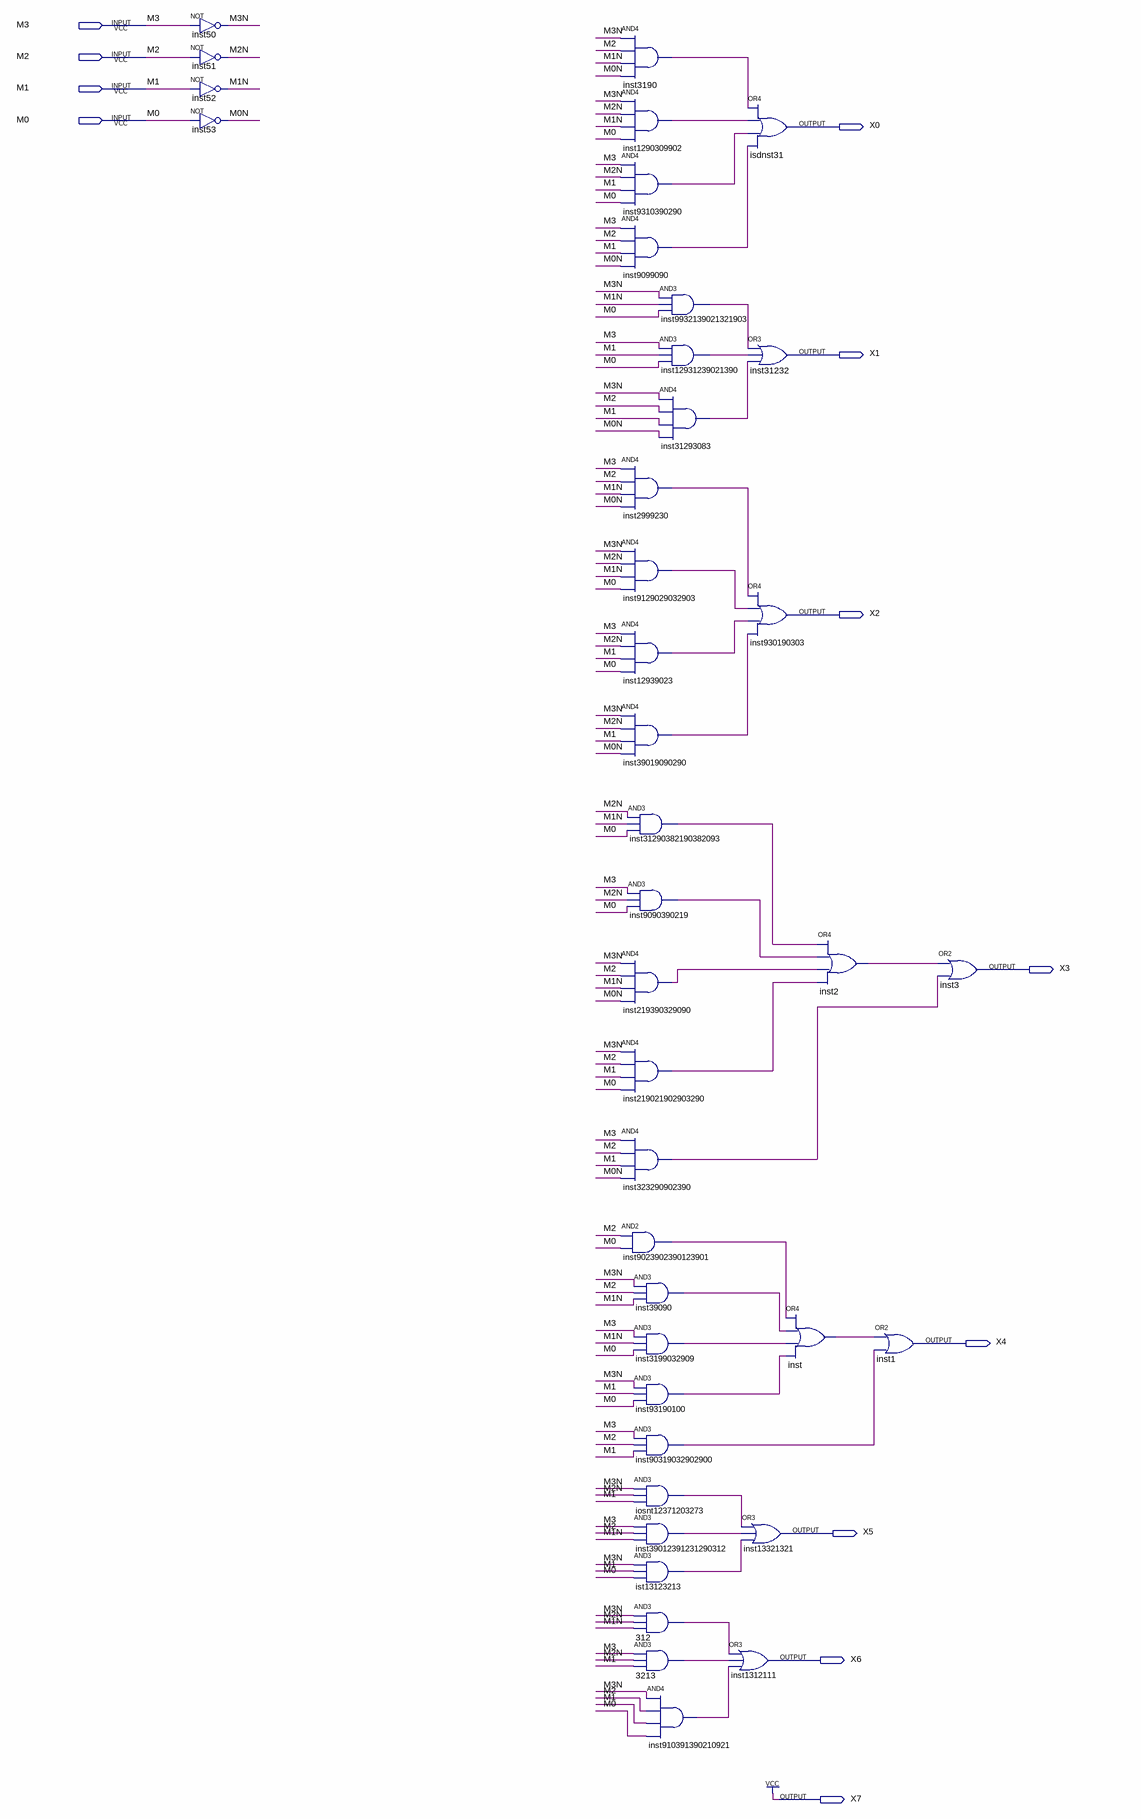
[diagram p0: schematic sheet]
// Quartus schematic sevenSegmentDecoder.bdf as structural Verilog: 40 symbols, 12 pins
module sevenSegmentDecoder (
  input  M3,
  input  M2,
  input  M1,
  input  M0,
  output X0,
  output X1,
  output X2,
  output X3,
  output X4,
  output X5,
  output X6,
  output X7
);

  wire inst2_out, inst3190_out, inst39090_out, inst2999230_out, inst9099090_out, inst12939023_out,
       inst31293083_out, inst93190100_out, inst1290309902_out, inst3199032909_out, inst9090390219_out,
       inst9310390290_out, inst39019090290_out, inst219390329090_out, inst323290902390_out,
       inst9129029032903_out, inst12931239021390_out, inst90319032902900_out, inst219021902903290_out,
       inst910391390210921_out, inst9023902390123901_out, inst9932139021321903_out,
       inst31290382190382093_out, inst39012391231290312_out, inst_out, iosnt12371203273_out, ist13123213_out,
       M0N, M1N, M2N, M3N, n312_out, n3213_out;

  not inst50 (M3N, M3);
  not inst51 (M2N, M2);
  not inst52 (M1N, M1);
  not inst53 (M0N, M0);
  and inst3190 (inst3190_out, M3N, M2, M1N, M0N);
  and inst1290309902 (inst1290309902_out, M3N, M2N, M1N, M0);
  and inst9310390290 (inst9310390290_out, M3, M2N, M1, M0);
  and inst9099090 (inst9099090_out, M3, M2, M1, M0N);
  and inst2999230 (inst2999230_out, M3, M2, M1N, M0N);
  and inst9129029032903 (inst9129029032903_out, M3N, M2N, M1N, M0);
  and inst12939023 (inst12939023_out, M3, M2N, M1, M0);
  and inst39019090290 (inst39019090290_out, M3N, M2N, M1, M0N);
  and inst31290382190382093 (inst31290382190382093_out, M2N, M1N, M0);
  and inst9090390219 (inst9090390219_out, M3, M2N, M0);
  and inst219390329090 (inst219390329090_out, M3N, M2, M1N, M0N);
  and inst219021902903290 (inst219021902903290_out, M3N, M2, M1, M0);
  and inst323290902390 (inst323290902390_out, M3, M2, M1, M0N);
  and inst9023902390123901 (inst9023902390123901_out, M2, M0);
  and inst39090 (inst39090_out, M3N, M2, M1N);
  and inst3199032909 (inst3199032909_out, M3, M1N, M0);
  and inst93190100 (inst93190100_out, M3N, M1, M0);
  and inst90319032902900 (inst90319032902900_out, M3, M2, M1);
  and iosnt12371203273 (iosnt12371203273_out, M3N, M2N, M1);
  and inst39012391231290312 (inst39012391231290312_out, M3, M2, M1N);
  and ist13123213 (ist13123213_out, M3N, M1, M0);
  and u_312 (n312_out, M3N, M2N, M1N);
  and u_3213 (n3213_out, M3, M2N, M1);
  and inst910391390210921 (inst910391390210921_out, M3N, M2, M1, M0);
  and inst9932139021321903 (inst9932139021321903_out, M3N, M1N, M0);
  and inst12931239021390 (inst12931239021390_out, M3, M1, M0);
  and inst31293083 (inst31293083_out, M3N, M2, M1, M0N);
  or isdnst31 (X0, inst3190_out, inst1290309902_out, inst9310390290_out, inst9099090_out);
  or inst31232 (X1, inst9932139021321903_out, inst12931239021390_out, inst31293083_out);
  or inst930190303 (X2, inst2999230_out, inst9129029032903_out, inst12939023_out, inst39019090290_out);
  or inst13321321 (X5, iosnt12371203273_out, inst39012391231290312_out, ist13123213_out);
  or inst1312111 (X6, n312_out, n3213_out, inst910391390210921_out);
  or inst (inst_out, inst9023902390123901_out, inst39090_out, inst3199032909_out, inst93190100_out);
  or inst2 (inst2_out, inst31290382190382093_out, inst9090390219_out, inst219390329090_out, inst219021902903290_out);
  or inst1 (X4, inst_out, inst90319032902900_out);
  or inst3 (X3, inst2_out, inst323290902390_out);

  assign X7 = 1'b1;
endmodule
